# EAGLE design thermometer (EAGLE 7.3.0)
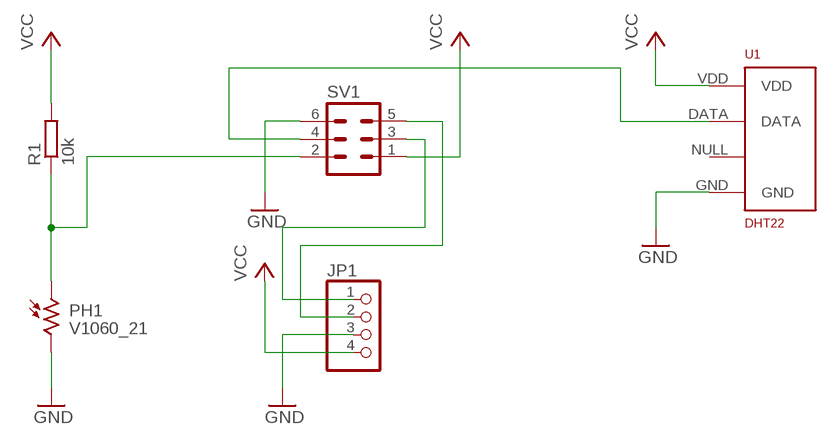
[diagram p0: schematic, sheet 1]

## Parts
JP1  PINHD-1X4  [1X04]
PH1  V1060_21  [TO-5_V10]
R1  10k  R-EU_0207/12  [0207/12]
SV1  ML6  [ML6]
U1  DHT22  RHT03_DHT-22_AM2302RA  [RHT03_DHT-22/RA]

## Nets
GND: JP1.3 PH1.2 SV1.6 U1.GND
N$1: PH1.1 R1.1 SV1.2
N$2: JP1.1 SV1.3
N$3: SV1.4 U1.DATA
N$4: JP1.2 SV1.5
VCC: JP1.4 R1.2 SV1.1 U1.VDD
Unconnected: U1.NULL

## Library data of the parts
JP1 = pinhead:PINHD-1X4: PIN HEADER
PH1 = photo-elements:?1060*: Sensor Street Light control Source: http://optoelectronics.perkinelmer.com/content/Datasheets/DTS_PhotocellsB1060.pdf
R1 = rcl:R-EU_: RESISTOR, European symbol
SV1 = con-harting-ml:ML6: HARTING; OC_FARNELL: unknown; OC_NEWARK: unknown
U1 = RHT03_DHT-22_AM2302:RHT03_DHT-22_AM2302: RHT03 / DHT-22 / AM2302 Packages and symbol for the RHT03 / DHT-22 relative humidity and temperature sensor. Note: The AM2302 is a wired version of the DHT-22 which typically requires less clearance and is thus provided as a separate package.; PROD_ID: SEN-10167

## Board
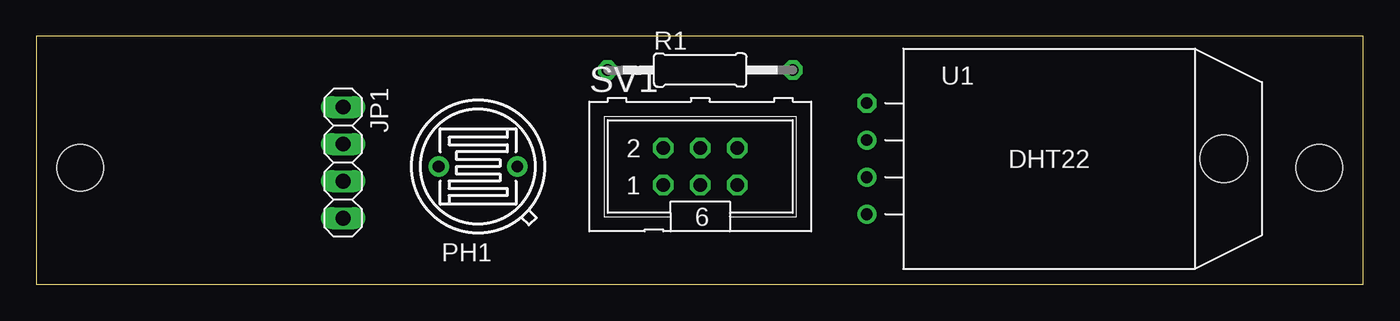
[diagram p1: board, top side]
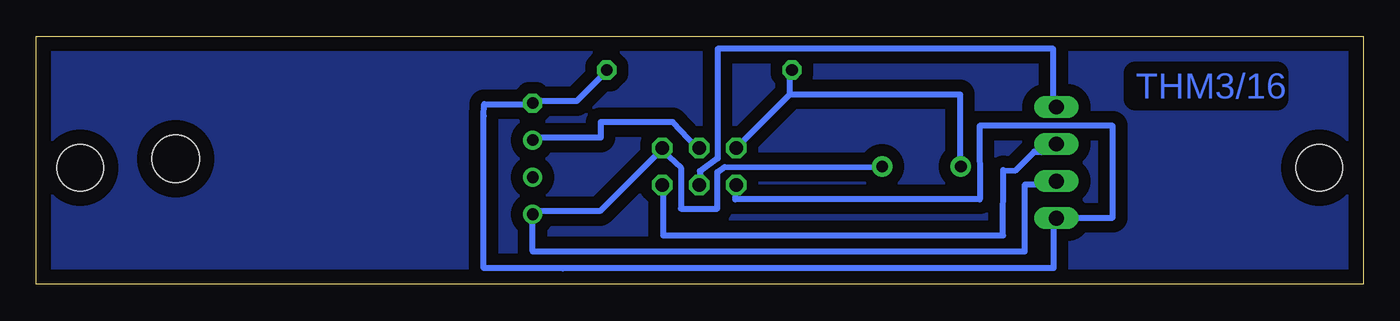
[diagram p2: board, bottom side, seen from below]

Size 91 x 17 mm. Coordinates in mm from the lower left corner, seen from the top.
Outline: 0,0 91,0 91,17 0,17 0,0
Copper layers (1*16): Top 0.035mm / dielectric 1.5mm / Bottom 0.035mm
Design rules "default": minimum track width 10mil, minimum drill 24mil, track to track 8mil, track to pad 8mil, pad to pad 8mil, via to via 8mil, smd to smd 8mil, copper to edge 40mil, drill to drill 8mil, minimum pad ring 10mil, minimum via ring 8mil, stop-mask expansion 4mil, vias tented up to drill 0mil, thermal gap 10mil
Holes 3.2 mm at 88,8 3,8

### Footprints (pad centres in the part's own frame; a part is rotated, then mirrored left to right if it is on the bottom)
1X04 = drill 1.016 long: 1 -3.81,0; 2 -1.27,0; 3 1.27,0; 4 3.81,0
TO-5_V10 = drill 0.8 pad 1.4: 1 -2.7,0; 2 2.7,0
0207/12 = drill 0.813 octagon: 1 -6.35,0; 2 6.35,0
ML6 = drill 0.914 octagon: 1 -2.54,-1.27; 2 -2.54,1.27; 3 0,-1.27; 4 0,1.27; 5 2.54,-1.27; 6 2.54,1.27
RHT03_DHT-22/RA = drill 0.8: DATA -1.27,0; GND 3.81,0; NULL 1.27,0 | drill 0.8 octagon: VDD -3.81,0 | hole 3.25: 0,24.5

### Placement (x,y rotation side)
JP1  21.04,8.35 270 top
PH1  30.29,8.08 0 top
R1  45.53,14.7 0 top
SV1  45.53,8.08 0 top
U1  56.96,8.62 270 top

### Tracks (layer width: path | path; a pad name or v marks a point on that pad's centre or on a via)
GND
  Bottom 0.254: 56.92,5.03 U1.GND | 48.23,9.14 SV1.6 48.01,9.14 | 33.33,8.03 PH1.2 | 21.26,6.86 JP1.3
  Bottom 0.406: 56.92,5.03 52.35,5.03 48.23,9.14 | 33.33,8.03 43.78,8.05 44.28,7.7 44.28,5.19 46.79,5.19 46.79,8 48.01,9.14 | 21.26,6.86 23.19,6.86 23.2,2.26 56.96,2.26 U1.GND
N$1
  Bottom 0.254: 39.32,14.63 R1.1 | 42.98,9.37 SV1.2 | 27.66,8.23 PH1.1
  Bottom 0.406: 39.32,13.03 39.32,14.63 | 42.98,9.37 39.32,13.03 | 27.66,8.23 27.65,13.03 39.32,13.03
N$2
  Bottom 0.254: 45.49,6.86 SV1.3 | 21.26,12.34 JP1.1
  Bottom 0.406: 45.49,6.86 45.49,7.77 44.27,8.64 44.27,16.15 21.26,16.15 21.26,12.34
N$3
  Bottom 0.254: 56.92,10.06 U1.DATA | 45.72,9.37 SV1.4
  Bottom 0.406: 56.92,10.06 52.3,10.06 52.3,11.12 47.36,11.12 45.72,9.37
N$4
  Bottom 0.406: SV1.5 48.01,6.81 48.01,3.35 24.69,3.35 24.68,7.84 23.86,7.8 22.55,9.11 21.55,9.11 JP1.2
N$5
  pour Bottom (isolate 0.813): 0,17.01 0,0 91,0 91,17.01
VCC
  Bottom 0.254: 56.92,12.57 U1.VDD 57.15,12.34 | 51.89,14.63 R1.2 | 21.03,4.57 JP1.4
  Bottom 0.406: 56.92,12.57 53.95,12.57 51.89,14.63 | 21.03,4.57 17.17,4.58 17.17,10.87 26.3,10.87 26.29,5.83 43.05,5.83 SV1.1 | 57.15,12.34 60.29,12.36 60.31,11.54 60.31,1.12 54.9,1.09 21.23,1.12 21.26,4.34 JP1.4

### Text on the board
Bottom: THM3/16